# Altium schematic sheet PWR.SchDoc (part 1 of 3)
size A4; SheetNumber: 2; SheetTotal: 3
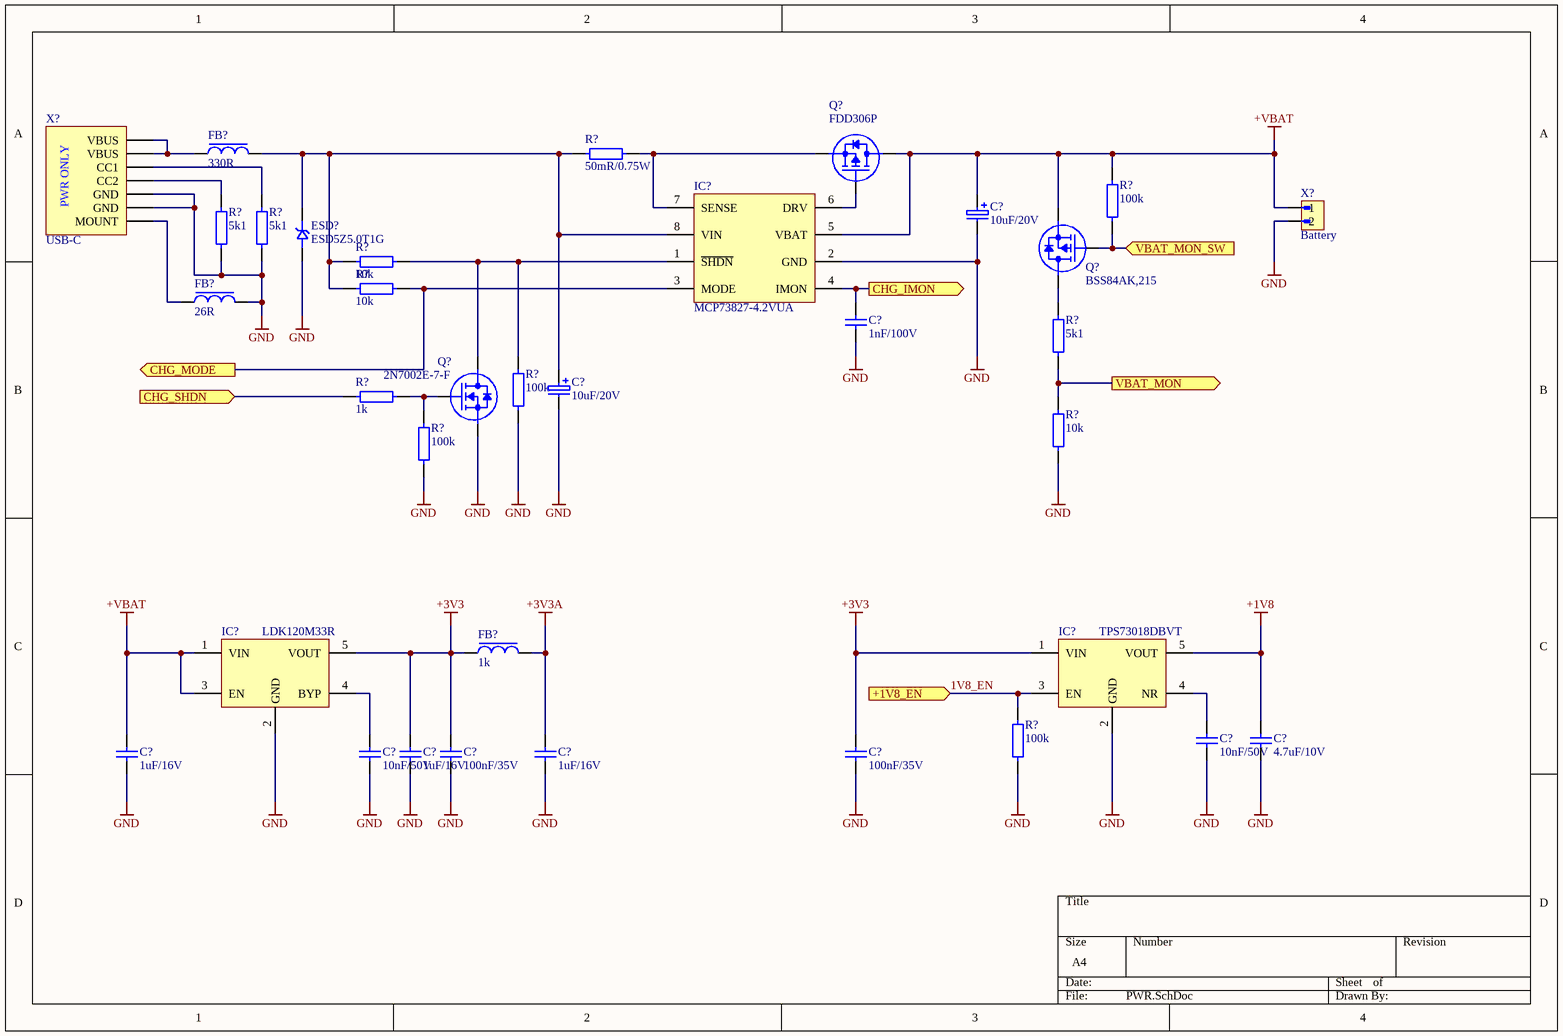
[diagram p0: PWR.SchDoc]

## Parts
(Parts that share a designator on the sheet are numbered #1, #2 ... from top to bottom, then left to right.)
C?#1  10uF/20V  [C_T3528 EIA-B]
C?#2  1nF/100V  [C0603]
C?#3  10uF/20V  [C_T3528 EIA-B]
C?#4  4.7uF/10V  [C0603]
C?#5  10nF/50V  [C0603]
C?#6  1uF/16V  [C0603]
C?#7  10nF/50V  [C0603]
C?#8  1uF/16V  [C0603]
C?#9  100nF/35V  [C0603]
C?#10  1uF/16V  [C0603]
C?#11  100nF/35V  [C0603]
ESD?  ESD5Z5.0T1G  [SOD523]
FB?#1  330R  [FB0603]
FB?#2  26R  [FB0603]
FB?#3  1k  [FB0603]
IC?#1  MCP73827-4.2VUA  [TSSOP8]
IC?#2  LDK120M33R  [SOT23-5]
IC?#3  TPS73018DBVT  [SOT23-5]
Q?#1  FDD306P  [TO252-3 (DPAK)]
Q?#2  BSS84AK,215  [SOT23-3]
Q?#3  2N7002E-7-F  [SOT23-3]
R?#1  50mR/0.75W  [R1206]
R?#2  100k  [R0603]
R?#3  5k1  [R0603]
R?#4  5k1  [R0603]
R?#5  10k  [r0603]
R?#6  10k  [r0603]
R?#7  5k1  [R0603]
R?#8  1k  [R0603]
R?#9  100k  [R0603]
R?#10  10k  [r0603]
R?#11  100k  [R0603]
R?#12  100k  [R0603]
X?#1  USB-C  [USBC-6P]
X?#2  Battery  [B2B-XH-A (LF)(SN)]

## Ports
+1V8_EN (in), CHG_IMON (out), CHG_MODE (out), CHG_SHDN (in), VBAT_MON (out), VBAT_MON_SW (in)

## Nets
+1V8: C?#4.1 IC?#3.5(VOUT)
+3V3: C?#8.2 C?#9.2 C?#11.2 FB?#3.1 IC?#2.5(VOUT) IC?#3.1(VIN)
+3V3A: C?#10.2 FB?#3.2
+VBAT: C?#1.1 C?#6.2 IC?#1.5(VBAT) IC?#2.1(VIN) IC?#2.3(EN) Q?#1.2(D) Q?#2.2(S) R?#2.2 X?#2.1
GND: C?#1.2 C?#2.1 C?#3.2 C?#4.2 C?#5.1 C?#6.1 C?#7.1 C?#8.1 C?#9.1 C?#10.1 C?#11.1 ESD?.A FB?#2.2 IC?#1.2(GND) IC?#2.2(GND) IC?#3.2(GND) Q?#3.2(S) R?#3.2 R?#4.2 R?#9.1 R?#10.2 R?#11.1 R?#12.1 X?#1.A12(GND) X?#1.B12(GND) X?#2.2
1V8_EN: IC?#3.3(EN) R?#12.2 ; port +1V8_EN
CHG_IMON: C?#2.2 IC?#1.4(IMON) ; port CHG_IMON
CHG_MODE: IC?#1.3(MODE) R?#6.1 ; port CHG_MODE
CHG_SHDN: R?#8.1 ; port CHG_SHDN
VBAT_MON: R?#7.2 R?#10.1 ; port VBAT_MON
VBAT_MON_SW: Q?#2.1(G) R?#2.1 ; port VBAT_MON_SW
NetC?#3_1: C?#3.1 ESD?.K FB?#1.2 IC?#1.8(VIN) R?#1.1 R?#5.2 R?#6.2
NetC?#5_2: C?#5.2 IC?#3.4(NR)
NetC?#7_2: C?#7.2 IC?#2.4(BYP)
NetFB?#1_1: FB?#1.1 X?#1.A9(VBUS) X?#1.B9(VBUS)
NetFB?#2_1: FB?#2.1 X?#1.M(MOUNT)
NetIC?#1_1: IC?#1.1(~{SHDN}) Q?#3.3(D) R?#5.1 R?#9.2
NetIC?#1_6: IC?#1.6(DRV) Q?#1.1(G)
NetIC?#1_7: IC?#1.7(SENSE) Q?#1.3(S) R?#1.2
NetQ?#2_3: Q?#2.3(D) R?#7.1
NetQ?#3_1: Q?#3.1(G) R?#8.2 R?#11.2
NetR?#3_1: R?#3.1 X?#1.B5(CC2)
NetR?#4_1: R?#4.1 X?#1.A5(CC1)